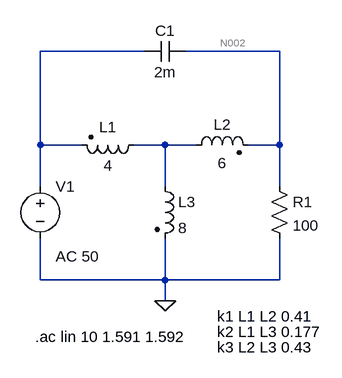
[diagram p0: schematic Task1.asc]
Task1.asc, the LTspice schematic file:
Version 4
SHEET 1 880 680
WIRE 272 -64 112 -64
WIRE 480 -64 336 -64
WIRE 112 80 112 -64
WIRE 176 80 112 80
WIRE 304 80 256 80
WIRE 352 80 304 80
WIRE 480 80 480 -64
WIRE 480 80 432 80
WIRE 112 144 112 80
WIRE 304 144 304 80
WIRE 480 144 480 80
WIRE 112 288 112 224
WIRE 304 288 304 224
WIRE 304 288 112 288
WIRE 480 288 480 224
WIRE 480 288 304 288
WIRE 304 320 304 288
FLAG 304 320 0
SYMBOL voltage 112 128 R0
WINDOW 123 24 124 Left 2
WINDOW 39 0 0 Left 0
SYMATTR Value2 AC 50
SYMATTR InstName V1
SYMATTR Value ""
SYMBOL cap 272 -48 R270
WINDOW 0 32 32 VTop 2
WINDOW 3 0 32 VBottom 2
SYMATTR InstName C1
SYMATTR Value 2m
SYMBOL ind2 272 64 R90
WINDOW 0 4 56 VBottom 2
WINDOW 3 32 56 VTop 2
SYMATTR InstName L1
SYMATTR Value 4
SYMBOL ind2 336 96 R270
WINDOW 0 32 56 VTop 2
WINDOW 3 4 56 VBottom 2
SYMATTR InstName L2
SYMATTR Value 6
SYMBOL ind2 288 128 R0
SYMATTR InstName L3
SYMATTR Value 8
SYMBOL res 464 128 R0
SYMATTR InstName R1
SYMATTR Value 100
TEXT 384 344 Left 2 !k1 L1 L2 0.41
TEXT 384 368 Left 2 !k2 L1 L3 0.177
TEXT 384 392 Left 2 !k3 L2 L3 0.43
TEXT 104 376 Left 2 !.ac lin 10 1.591 1.592

The netlist it stands for:
* Task1.asc
V1 N001 0 AC 50
C1 N001 N002 2m
L1 N003 N001 4
L2 N003 N002 6
L3 N003 0 8
R1 N002 0 100
k1 L1 L2 0.41
k2 L1 L3 0.177
k3 L2 L3 0.43
.ac lin 10 1.591 1.592
.backanno
.end

* Results of the author's LTspice run, read from the files saved beside the schematic
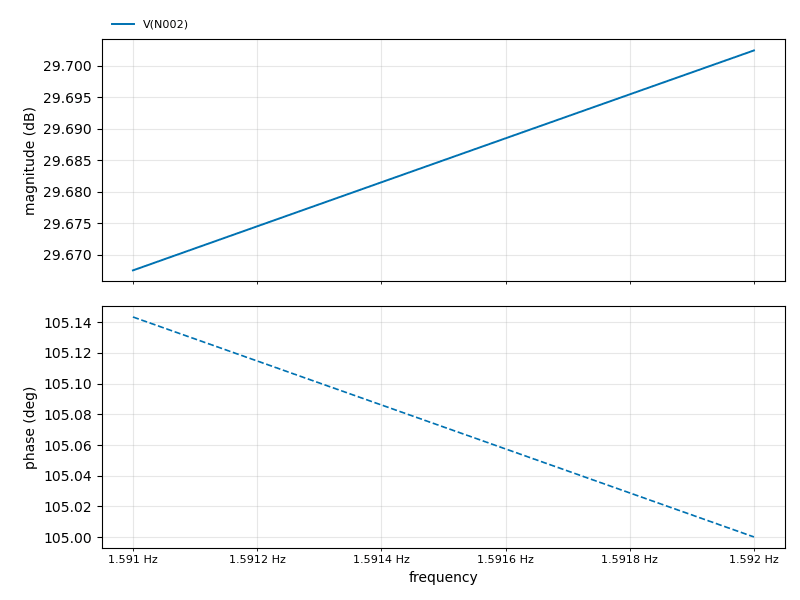
[diagram p1: AC Analysis of Task1.asc, plotted from the saved traces]
* AC Analysis, 1 run:
*   V(N002): 29.67 dB at 1.591 Hz, 29.70 dB at 1.592 Hz, peak 29.70 dB at 1.592 Hz